# EAGLE design Blocky_STM32F103 (EAGLE 9.2.2)
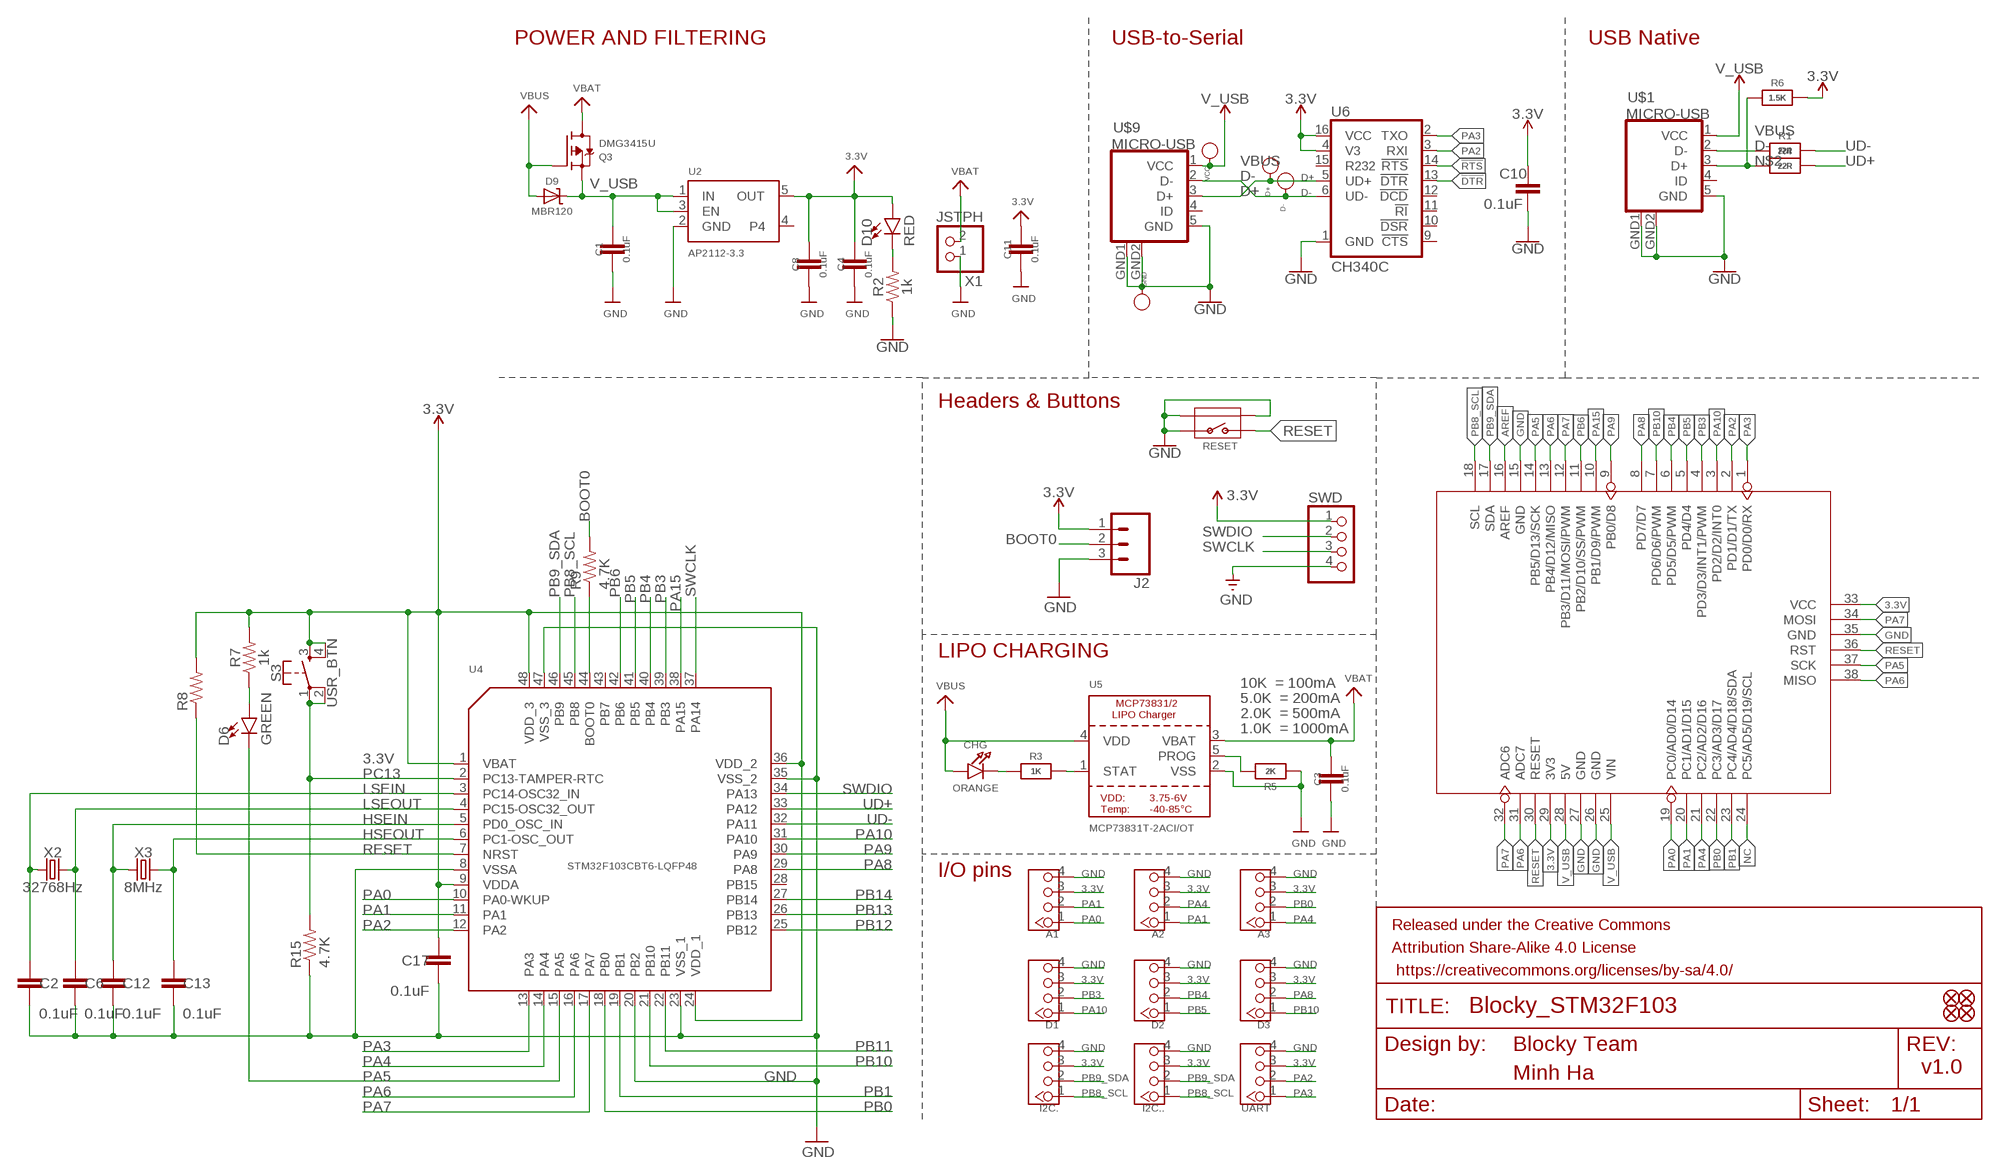
[diagram p0: schematic, sheet 1]

## Parts
A1  TWIG-4P-2.0-2.0  [4P-2.0]
A2  TWIG-4P-2.0-2.0  [4P-2.0]
A3  TWIG-4P-2.0-2.0  [4P-2.0]
C1  0.1uF  0.1UF-0603-25V-5%  [0603]
C2  0.1uF  0.1UF-0603-25V-5%  [0603]
C3  0.1uF  0.1UF-0603-25V-5%  [0603]
C4  0.1uF  0.1UF-0603-25V-5%  [0603]
C6  0.1uF  0.1UF-0603-25V-5%  [0603]
C8  0.1uF  0.1UF-0603-25V-5%  [0603]
C10  0.1uF  0.1UF-0603-25V-5%  [0603]
C11  0.1uF  0.1UF-0603-25V-5%  [0603]
C12  0.1uF  0.1UF-0603-25V-5%  [0603]
C13  0.1uF  0.1UF-0603-25V-5%  [0603]
C17  0.1uF  0.1UF-0603-25V-5%  [0603]
CHG  ORANGE  LED0603  [CHIPLED_0603]
D1  TWIG-4P-2.0-2.0  [4P-2.0]
D2  TWIG-4P-2.0-2.0  [4P-2.0]
D3  TWIG-4P-2.0-2.0  [4P-2.0]
D6  GREEN  LED-BLUE0603  [LED-0603]
D9  MBR120  DIODE-SCHOTTKYSOD-123  [SOD-123]
D10  RED  LED-RED0603  [LED-0603]
D+  PAD-TEST-POINT'4545'  [TP_4545]
D-  PAD-TEST-POINT'4545'  [TP_4545]
FD1  FIDUCIAL1X2  [FIDUCIAL-1X2]
FD2  FIDUCIAL1X2  [FIDUCIAL-1X2]
FD3  FIDUCIAL1X2  [FIDUCIAL-1X2]
FD4  FIDUCIAL1X2  [FIDUCIAL-1X2]
FRAME1  FRAME-LETTERNO_PACKAGE  [DUMMY]
GND  PAD-TEST-POINT'4545'  [TP_4545]
I2C.  TWIG-4P-2.0-2.0  [4P-2.0]
I2C..  TWIG-4P-2.0-2.0  [4P-2.0]
J2  CONN_031X03_NO_SILK  [1X03_NO_SILK]
Q3  DMG3415U  MOSFET-P  [SOT23-R]
R1  22R  RESISTOR_0603_NOOUT  [0603-NO]
R2  1k  1KOHM-0603-1/10W-1%  [0603]
R3  1K  RESISTOR_0603_NOOUT  [0603-NO]
R4  22R  RESISTOR_0603_NOOUT  [0603-NO]
R5  2K  RESISTOR_0603_NOOUT  [0603-NO]
R6  1.5K  RESISTOR_0603_NOOUT  [0603-NO]
R7  1k  1KOHM-0603-1/10W-1%  [0603]
R8  RESISTOR0603  [0603]
R9  4.7K  RESISTOR0603  [0603]
R15  4.7K  RESISTOR0603  [0603]
RESET  BUTTON-4P-REINFORCE'TS-1188E'  [4P-SMD-7X3.5X3.5H]
S3  USR_BTN  MOMENTARY-SWITCH-SPST-2-SMD-4.6X2.8MM  [TACTILE_SWITCH_SMD_4.6X2.8MM]
SWD  HEADER-1X4ROUND  [1X04_ROUND]
U2  AP2112-3.3  VREG_SOT23-5  [SOT23-5]
U3  ARDUINO-38P  [ARDUINO-38P]
U4  STM32F103CBT6-LQFP48  MCU-STM32F103CBT6(LQFP48)  [LQFP48-0.5-7X7MM]
U5  MCP73831T-2ACI/OT  MCP73831/2  [SOT23-5]
U6  CH340C  [SO016]
U$1  MICRO-USB  [MICRO-USB]
U$9  MICRO-USB  [MICRO-USB]
UART  TWIG-4P-2.0-2.0  [4P-2.0]
VCC  PAD-TEST-POINT'4545'  [TP_4545]
X1  JSTPH  CON_JST_PH_2PIN  [JSTPH2]
X2  32768Hz  CRYSTALSMD-3.2X1.5  [CRYSTAL-SMD-3.2X1.5MM]
X3  8MHz  CRYSTALSMD-5X3.2-2PAD  [CRYSTAL-SMD-5X3.2-2PAD]

## Nets
3.3V [usbvcc]: A1.3 A2.3 A3.3 C4.1 C8.1 C10.1 C11.1 C17.1 D1.3 D2.3 D3.3 D10.A I2C..3 I2C...3 J2.1 R6.2 R7.2 R8.2 S3.3 S3.4 SWD.1 U2.5(OUT) U3.29(3V3) U3.33(VCC) U4.1(VBAT) U4.9(VDDA) U4.24(VDD_1) U4.36(VDD_2) U4.48(VDD_3) U6.4(V3) U6.16(VCC) UART.3
!DTR: U6.13(!DTR)
!RTS: U6.14(!RTS)
AREF: U3.16(AREF)
BOOT0: J2.2 R9.2
D+: D+.T U6.5(UD+) U$9.3(D+)
D-: D-.T R1.1 U6.6(UD-) U$1.2(D-) U$9.2(D-)
GND: A1.4 A2.4 A3.4 C1.2 C2.2 C3.2 C4.2 C6.2 C8.2 C10.2 C11.2 C12.2 C13.2 C17.2 D1.4 D2.4 D3.4 GND.T I2C..4 I2C...4 J2.3 R2.1 R5.1 R15.1 RESET.1 RESET.S1 RESET.S2 SWD.4 U2.2(GND) U3.15(GND) U3.26(GND) U3.27(GND) U3.35(GND) U4.8(VSSA) U4.20(PB2) U4.23(VSS_1) U4.35(VSS_2) U4.47(VSS_3) U5.2(VSS) U6.1(GND) U$1.5(GND) U$1.GND1(GND) U$1.GND2(GND) U$9.5(GND) U$9.GND1(GND) U$9.GND2(GND) UART.4 X1.1
HSEIN: C12.1 U4.5(PD0_OSC_IN) X3.P$1
HSEOUT: C13.1 U4.6(PC1-OSC_OUT) X3.P$2
LSEIN: C2.1 U4.3(PC14-OSC32_IN) X2.P$1
LSEOUT: C6.1 U4.4(PC15-OSC32_OUT) X2.P$2
N$1: CHG.C R3.1
N$2 [usbvcc]: R4.1 R6.1 U$1.3(D+)
N$3: R9.1 U4.44(BOOT0)
N$4: D10.C R2.2
N$9: D6.A R7.1
NC: U3.24(PC5/AD5/D19/SCL)
PA0: A1.1 U3.19(PC0/AD0/D14) U4.10(PA0-WKUP)
PA1: A1.2 A2.1 U3.20(PC1/AD1/D15) U4.11(PA1)
PA2: U3.2(PD1/D1/TX) U4.12(PA2) U6.3(RXI) UART.2
PA3: U3.1(PD0/D0/RX) U4.13(PA3) U6.2(TXO) UART.1
PA4: A2.2 A3.1 U3.21(PC2/AD2/D16) U4.14(PA4)
PA5: D6.C U3.14(PB5/D13/SCK) U3.37(SCK) U4.15(PA5)
PA6: U3.13(PB4/D12/MISO) U3.31(ADC7) U3.38(MISO) U4.16(PA6)
PA7: U3.12(PB3/D11/MOSI/PWM) U3.32(ADC6) U3.34(MOSI) U4.17(PA7)
PA8: D3.2 U3.8(PD7/D7) U4.29(PA8)
PA9: U3.9(PB0/D8) U4.30(PA9)
PA10: D1.1 U3.3(PD2/D2/INT0) U4.31(PA10)
PA15: U3.10(PB1/D9/PWM) U4.38(PA15)
PB0: A3.2 U3.22(PC3/AD3/D17) U4.18(PB0)
PB1: U3.23(PC4/AD4/D18/SDA) U4.19(PB1)
PB3: D1.2 U3.4(PD3/D3/INT1/PWM) U4.39(PB3)
PB4: D2.2 U3.6(PD5/D5/PWM) U4.40(PB4)
PB5: D2.1 U3.5(PD4/D4) U4.41(PB5)
PB6: U3.11(PB2/D10/SS/PWM) U4.42(PB6)
PB8_SCL: I2C..1 I2C...1 U3.18(SCL) U4.45(PB8)
PB9_SDA: I2C..2 I2C...2 U3.17(SDA) U4.46(PB9)
PB10: D3.1 U3.7(PD6/D6/PWM) U4.21(PB10)
PB11: U4.22(PB11)
PB12: U4.25(PB12)
PB13: U4.26(PB13)
PB14: U4.27(PB14)
PC13: R15.2 S3.1 S3.2 U4.2(PC13-TAMPER-RTC)
PROG: R5.2 U5.5(PROG)
RESET: R8.1 RESET.2 U3.30(RESET) U3.36(RST) U4.7(NRST)
STAT: R3.2 U5.1(STAT)
SWCLK: SWD.3 U4.37(PA14)
SWDIO: SWD.2 U4.34(PA13)
UD+: R4.2 U4.33(PA12)
UD-: R1.2 U4.32(PA11)
V_USB [usbvcc]: C1.1 D9.C Q3.2(S) U2.1(IN) U2.3(EN) U3.25(VIN) U3.28(5V)
VBAT [usbvcc]: C3.1 Q3.3(D) U5.3(VBAT) X1.2
VBUS [usbvcc]: CHG.A D9.A Q3.1(G) U5.4(VDD) U$1.1(VCC) U$9.1(VCC) VCC.T ; supply symbol labelled V_USB
Unconnected: U2.4 U4.28(PB15) U4.43(PB7) U6.9(!CTS) U6.10(!DSR) U6.11(!RI) U6.12(!DCD) U6.15(R232) U$1.4(ID) U$9.4(ID)

## Notes on the sheet
- POWER AND FILTERING | USB-to-Serial | USB Native
- Headers & Buttons
- LIPO CHARGING
- 10K  = 100mA
- 5.0K  = 200mA
- 2.0K  = 500mA
- 1.0K  = 1000mA
- I/O pins
- Blocky Team
- v1.0
- Minh Ha

## Library data of the parts
A1 = Connector :TWIG-4P-2.0
A2 A3 D1-D3 I2C. I2C.. UART = Connector:TWIG-4P-2.0
C1-C4 C6 C8 C10-C13 C17 = SparkFun-Capacitors:0.1UF: 0.1µF ceramic capacitors A capacitor is a passive two-terminal electrical component used to store electrical energy temporarily in an electric field.; PROD_ID: CAP-08604
CHG = microbuilder:LED: LED 0603 - 0603 Surface Mount Package 2mA: Green LED - Low Power (3.9mcd, 2ma, 1.7Vf) - Digikey: 475-2709-2-ND Orange LED - Low Power (9.8mcd, 2ma, 1.8Vf) - Digikey: 475-1194-2-ND Red LED - Low Power (5mcd, 2ma, 1.8Vf) - Digikey: 475-1195-2-ND Yellow LED - Low Power (7mcd, 2ma, 1.8Vf) - Digikey: 475-1196-2-ND 5mA: Blue LED - Low Power (17mcd, 5ma, 2.9Vf) - Digikey: LNJ937W8CRACT-ND 0805 - 0805 Surface Mount Package 2mA: Red LED (8.8mcd, 2mA, 1.8Vf, Clear) - Low Power [Digikey: 475-2510-1-ND] Green LED (5mcd, 2mA, 1.8Vf, Clear) - Low Power [Digikey: 475-2730-1-ND] Yellow LED (11.3mcd, 2mA, 1.8Vf, Clear) - Low Power [Digikey: 475-2555-1-ND] 20mA: Red LED (104mcd, 20mA, Diffused) - LS R976 [Digikey: 475-1278-6-ND] Red LED (12mcd, 20mA, 2.0Vf, Clear) - APT2012EC [Digikey: 754-1128-1-ND] Green LED (15mcd, 20mA, 2.2Vf, Clear) - APT2012GC [Digikey: 754-1131-1-ND] Orange LED (160mcd, 20mA, 2.1Vf, Clear) - APT2012SECK [Digikey: 754-1130-1-ND] 1206 - 1206 Surface Mount Package Green LED (26mcd, 20mA, Diffused) - LG N971 [Digikey: 475-1407-6-ND] Red LED (15mcd, 20mA, Diffused) - LH N974 [Digikey: 475-1416-6-ND] Cree - Cree High-Power Surface Mount LEDs XPEBWT-L1-0000-00D50 - White 111lm 350mA 2.9Vf 6200K 110° XTEAWT-00-0000-00000LEE3 - White 114lm 350mA 2.85Vf 5000K 115° Everlight - Everlight 45-21 Series Surface Mount LEDs 45-21/QK2C-B2832AC2CB2/2T - Warm White 2000mcd 20mA 3.25Vf 3050K 120° 45-21/LK2C-B38452C4CB2/2T - Nuetral White 2000mcd 20mA 3.25Vf 4150K 120° 45-21/LK2C-B50634C6CB2/2T - Cold White 2200mcd 20mA 3.25Vf 5650K 120° PLCC2 Reverse Mount LS T77K-J1L2-1-0-2-R18-Z - Red 11.25mcd 2mA 1.8Vf 630nm 120° LO T77K-L1M2-24-Z - Orange 19.6mcd 2mA 1.8Vf 606nm 120° LY T77K-K2M1-26-Z - Yellow 15.7mcd 2mA 1.8Vf 587nm 120°
D6 = SparkFun-LED:LED-BLUE: Blue SMD LED Used in manufacturing of various products at SparkFun Packages: 0603 - SMD 0603 package [Product Link] <http://www.digikey.com/product-detail/en/SMLE12BC7TT86/511-1589-2-ND/1641808> 1206 - SMD1206 package [Product Link] <http://www.digikey.com/product-detail/en/lite-on-inc/LTST-C150TBKT/160-1643-1-ND/573584> SparkFun Products: ESP8266 Thing-Dev Board <https://www.sparkfun.com/products/13711> RedBoard <https://www.sparkfun.com/products/12757>; PROD_ID: DIO-08575; VALUE: BLUE
D9 = microbuilder:DIODE-SCHOTTKY
D10 = SparkFun-LED:LED-RED: Red SMD LED Used in manufacturing of most products at SparkFun Packages: 0603 - SMD 0603 package [Product Link] <http://docs.avagotech.com/docs/AV02-0551EN> 0603 SMART - SMD 0603 SMART package ( more efficient and expensive)[Product Link] <http://www.osram-os.com/Graphics/XPic2/00077099_0.pdf> 1206 - SMD1206 package [Product Link] <https://www.sparkfun.com/datasheets/DevTools/LilyPad/Q150OVS4.pdff> SparkFun Products: Pro Mini 328 -5V <https://www.sparkfun.com/products/821> RedBoard <https://www.sparkfun.com/products/12757> IOIO-OTG <https://www.sparkfun.com/products/13613>; PROD_ID: DIO-00819
D+ D- GND VCC = Discrete:PAD-TEST-POINT; PARTNO: DNP
FD1-FD4 = SparkFun-Aesthetics:FIDUCIAL: Fiducial Alignment Points Point-of-reference for pick-and-place machines and other optical instruments.
FRAME1 = SparkFun-Aesthetics:FRAME-LETTER: Schematic Frame Standard 8.5x11 US Letter frame; DESIGNER: Nobody; VERSION: v01
J2 = SparkFun-Connectors:CONN_03: Multi connection point. Often used as Generic Header-pin footprint for 0.1 inch spaced/style header connections On any of the 0.1 inch spaced packages, you can populate with these: Break Away Headers - Straight (PRT-00116) Break Away Male Headers - Right Angle (PRT-00553) Female Headers (PRT-00115) Break Away Headers - Machine Pin (PRT-00117) Break Away Female Headers - Swiss Machine Pin (PRT-00743) Stackable Header - 3 Pin (Female, 0.1") (PRT-13875) For SCREWTERMINALS and SPRING TERMINALS visit here: Screw Terimnals on SparkFun.com (5mm/3.5mm/2.54mm spacing) This device is also useful as a general connection point to wire up your design to another part of your project. Our various solder wires solder well into these plated through hole pads. Hook-Up Wire - Assortment (Stranded, 22 AWG) (PRT-11375) Hook-Up Wire - Assortment (Solid Core, 22 AWG) (PRT-11367) View the entire wire category on our website here Special notes: Molex polarized connector foot print use with SKU : PRT-08232 with associated crimp pins and housings.
Q3 = microbuilder:MOSFET-P: P-Channel Mosfet LEGEND VDS: Voltage Drain-Source ID: Drain Current RDS(ON): Drain-Source On-State Resistance VGS(TH): Gate-Source Threshold Voltage CISS: Drain-Source Input Capacitance SOT-23 Name VDS ID RDS(ON) VGS(TH) CISS Order Number IRLML5103 30V 760mA 600 mOhm -- 75pF @ 25V Digikey: IRLML5103PBFCT-ND IRLML6401 12V 4.3A 50 mOhm 950mV @ 250µA 830pF @ 10V Digikey: IRLML6401PBFTR-ND NTR0202PL 20V 400mA 800 mOhm 2.3V @ 250uA 70pF @ 5V Digikey: NTR0202PLT1GOSTR-ND NTR4101PT1G 20V 1.8A 85 mOhm 1.2V @ 250uA 675pF @ 10V Digikey: NTR4101PT1GOSCT-ND DMP2004K 20V 600mA 900 mOhm 1V @ 250uA 175pF @ 16V Digikey: DMP2004KDICT-ND PMV65XP 20V 3.9A 76 mOhm 950mV @ 1mA 725pF @ 20V Digikey: 568-2358-2-ND TO-252 Name VDS ID RDS(ON) VGS(TH) CISS Order Number AOD417 30V 25A 34 mOhm 3V @ 250µA 920pF @ 15V Digikey: 785-1106-2-ND PowerPak Name VDS ID RDS(ON) VGS(TH) CISS Order Number AON7401 30V 12A 14 mOhm 3V @ 250µA 2600pF @ 15V Digikey: 785-1302-1-ND
R1 R3-R6 = microbuilder:RESISTOR: Resistors For new designs, use the packages preceded by an '_' character since they are more reliable: The following footprints should be used on most boards: _0402 - Standard footprint for regular board layouts _0603 - Standard footprint for regular board layouts _0805 - Standard footprint for regular board layouts _1206 - Standard footprint for regular board layouts For extremely tight-pitch boards where space is at a premium, the following 'micro-pitch' footprints can be used (smaller pads, no silkscreen outline, etc.): _0402MP - Micro-pitch footprint for very dense/compact boards _0603MP - Micro-pitch footprint for very dense/compact boards _0805MP - Micro-pitch footprint for very dense/compact boards _1206MP - Micro-pitch footprint for very dense/compact boards
R2 R7 = SparkFun-Resistors:1KOHM: 1kΩ resistor A resistor is a passive two-terminal electrical component that implements electrical resistance as a circuit element. Resistors act to reduce current flow, and, at the same time, act to lower voltage levels within circuits. - Wikipedia; PROD_ID: RES-07856
R8 R9 R15 = SparkFun-Resistors:RESISTOR: Generic Resistor Package
RESET = Discrete:BUTTON-4P-REINFORCE: TS-1188E http://www.best-dz.com/?thread-374-2.html
S3 = SparkFun-Switches:MOMENTARY-SWITCH-SPST-2: Momentary Switch (Pushbutton) - SPST - Two Circuits Normally-open (NO) SPST momentary switches (buttons, pushbuttons). Schematic symbol includes two switch circuits. Variants SMD-4.6MMX2.8MM - 4.60mm x 2.80mm Tactile Momentary Button Switch - Used on SparkFun SAMD21 Mini Breakout SMD-5.2MM - Mini Pushbutton Switch - SMD - Used on Arduino Pro Mini; PROD_ID: SWCH-13065
SWD = microbuilder:HEADER-1X4: PIN HEADER
U2 = microbuilder:VREG_SOT23-5: SOT23-5 Fixed Voltage Regulators Part Current Out V Out V In V Dropout θJA (°C/W) TJ (°C) Digikey Part No. ADP121 150mA 3.3V 3.4-5.5V 0.09V @ 150mA -- -- ADP121-AUJZ33R7CT-ND ADP121 150mA 3.0V 3.1-5.5V 0.09V @ 150mA -- -- ADP121-AUJZ30R7CT-ND ADP122 300mA 3.3V 3.4-5.5V 0.085V @ 300mA -- -- ADP122AUJZ-3.3-R7CT-ND ADP1712 300mA 3.3V 3.5-5.5V 0.17V @ 300mA -- -- ADP1712AUJZ-3.3-R7TR-ND AP7311 (Low Cost) 150mA 3.3V 3.5-6V 0.15V @ 150mA -- -- AP7311-33WG-7DICT-ND LD39015M18R 150mA 1.8V 1.9V-5.5V 0.08V @ 100mA -- -- 497-6977-1-ND LP2985A-33DBVR 150mA 3.3V 3.3-16V 0.28V @ 150mA 206 150 296-18479-1-ND MCP1824T-3302E/OT 300mA 3.3V 3.5V-6V 0.2V @ 300mA -- -- MCP1824T-3302E/OTCT-ND MIC5205-2.5YM5 TR 150mA 2.5V 2.7-16V 0.165V @ 150mA -- -- 576-1257-2-ND MIC5205-3.0YM5 TR 150mA 3.0V 3.2V-16V 0.165V @ 150mA -- -- 576-1258-2-ND MIC5205-3.3YM5 TR 150mA 3.3V 3.5V-16V 0.165V @ 150mA -- -- 576-1259-2-ND TPS780330220 150mA 3.3V+2.2V 3.6-5.5V 250mV Max -- -- 296-23332-1-ND TDA3663/N1,135 100mA 3.3V 3.5-45V 0.18V @ 50mA -- -- 568-5343-1-ND Max operating temp can be calculated using θJA, TJ (max junction temperature), and power in watts. Set the "Maximum Ambient Temperature" until it reaches TJ ("Max Junction Temperature"), which is the absolute limit for safe use of the regulator: Heat Sink Temperature Calculator For example, With 12V source into a 3.3V LP2985 and a 30mA load, we are dissipating (12V-3.3V) * 0.03A = 0.261W. With a θJA of 206 °C/W, a TJ of 150°C, and 261mW we can safely use the chip without a heat sink up to 75°C (=147.1°C Junction Temperature).
U3 = moudle:ARDUINO-38P
U4 = Seeed-OPL-ic:MCU-STM32F103CBT6(LQFP48): 310010004; MPN: STM32F103CBT6
U5 = microbuilder:MCP73831/2: MCP73831/2 LIPO Charger VDD: 3.75 - 6V Temp -40 - 85°C Programmable Charge Rate: 15-500mA NOTE: STAT is a tri-state logic output on the MCP73831 and an open-drain output on the MCP73832. SOT23-5 with 4.2V output and tri-state logic on STAT = MCP73831T-2ACI/OT
U6 = SparkFun-IC-Comms:CH340C; PROD_ID: IC-14038
U$1 U$9 = My-Eagle-Lib:MICRO-USB: Micro USB B connector
X1 = microbuilder:CON_JST_PH_2PIN: JST 2-Pin Right-Angle Connector PH-Series - 4UConnector: 17311 SH-Series - 4UConnector: 07278
X2 X3 = SparkFun-Clocks:CRYSTAL: Crystals (Generic) These are passive quartz crystals, which can be used as a clock source for a microcontroller. Crystal's are two-terminal devices. They require external "load" capacitors to generate an oscillating signal.

## Net classes
1 power: width 0.305 mm, clearance 0.203 mm
3 usbvcc: width 0.305 mm, clearance 0.203 mm

## Board
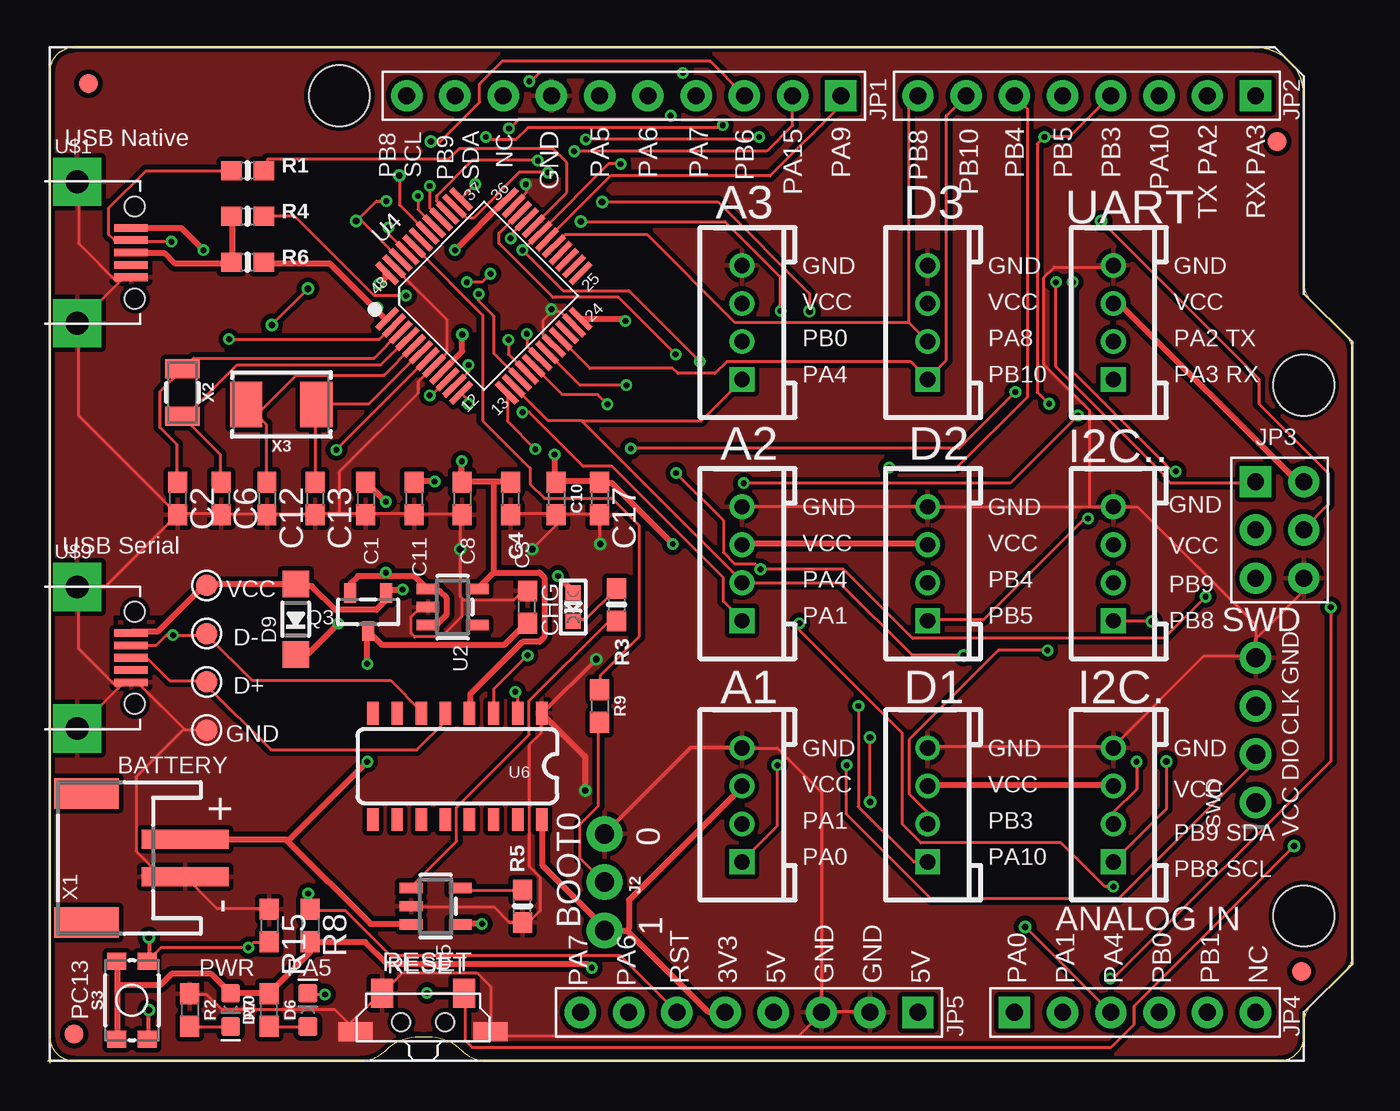
[diagram p1: board, top side]
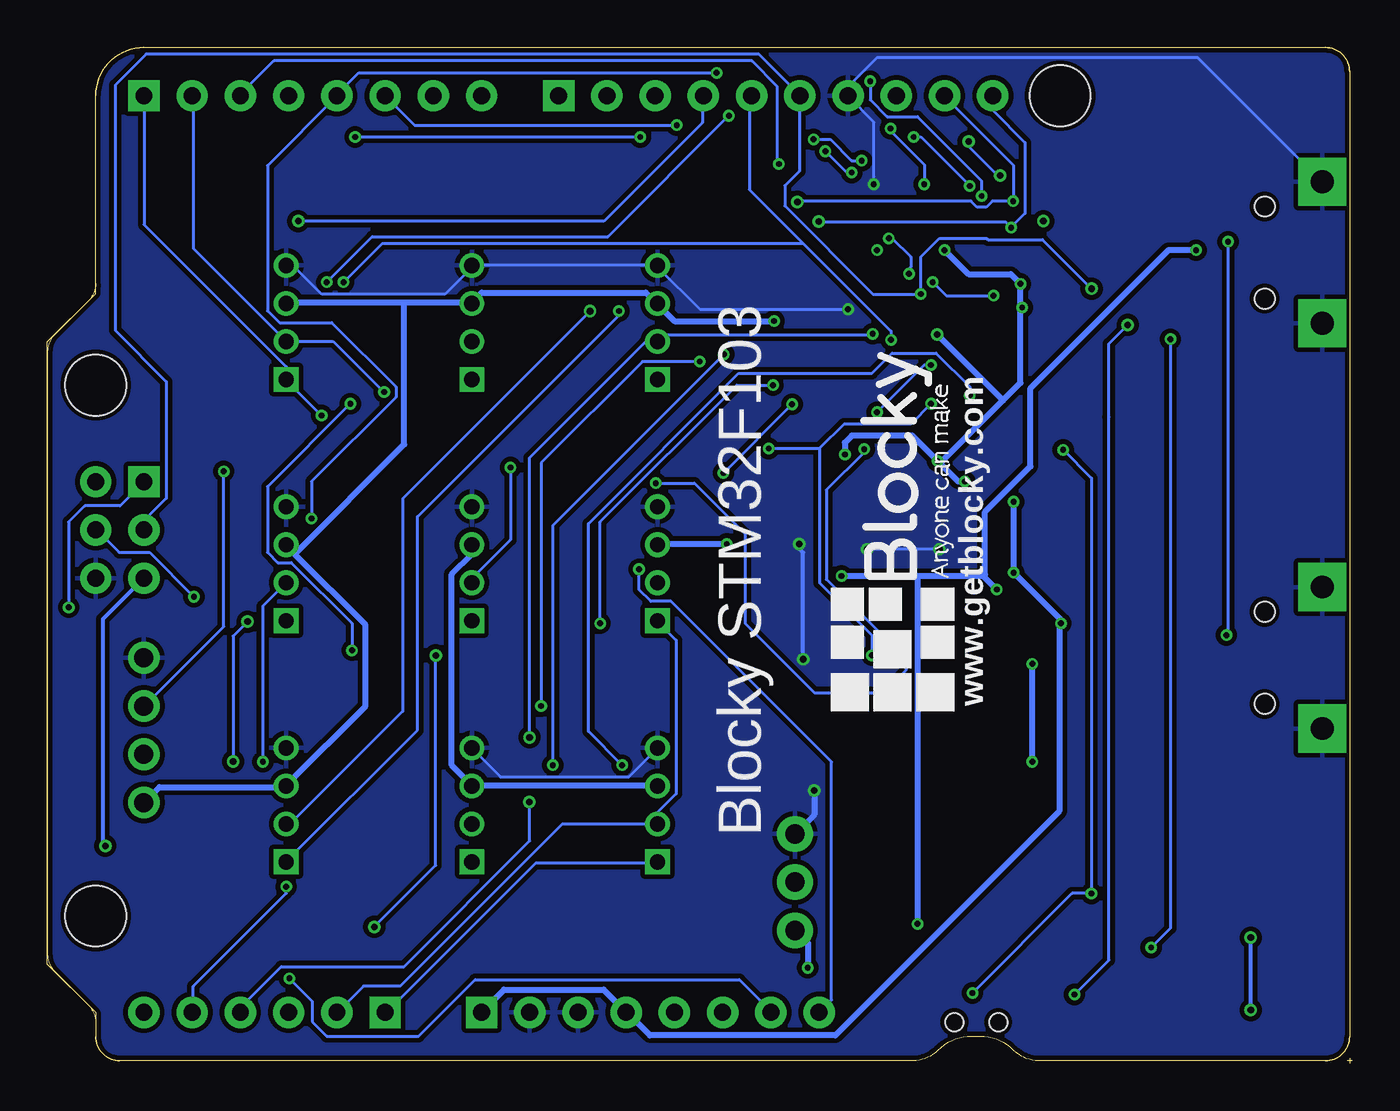
[diagram p2: board, bottom side, seen from below]

Size 68.71 x 53.47 mm. Coordinates in mm from the lower left corner, seen from the top.
Outline: 53 segments
Copper layers (1*16): Top 0.035mm / dielectric 1.5mm / Bottom 0.035mm
Design rules "SeeedStudio_rule_no_angle_090911 *": minimum track width 6mil, minimum drill 12mil, track to track 8mil, track to pad 8mil, pad to pad 8mil, via to via 8mil, smd to smd 0mil, copper to edge 10mil, drill to drill 10mil, minimum pad ring 10mil, minimum via ring 6mil, stop-mask expansion 2mil, vias tented up to drill 100mil, thermal gap 10mil

### Footprints (pad centres in the part's own frame; a part is rotated, then mirrored left to right if it is on the bottom)
4P-2.0 = drill 0.8 pad 1.27 square: 1 -3,0 | drill 0.8 pad 1.27: 2 -1,0; 3 1,0; 4 3,0
0603 = smd 1.1 x 1: 1 -0.85,0; 2 0.85,0
CHIPLED_0603 = smd 0.8 x 0.8: A 0,-0.75; C 0,0.75
LED-0603 = smd 1 x 1: A -0.877,0; C 0.877,0
SOD-123 = smd 1.4 x 1.4: A 1.85,0; C -1.85,0
TP_4545 = smd 1.143 x 1.143: T 0,0
FIDUCIAL-1X2 = smd 1 x 1: 1 0,0
1X03_NO_SILK = drill 1.016 pad 1.88: 1 0,0; 2 2.54,0; 3 5.08,0
SOT23-R = smd 0.635 x 1.016: 1 -0.95,-1; 2 0.95,-1; 3 0,1
0603-NO = smd 1.075 x 1: 1 -0.85,0; 2 0.85,0
4P-SMD-7X3.5X3.5H = smd 1.143 x 1.524: 1 -2.159,1.524; 2 2.159,1.524 | smd 1.778 x 1.016: S1 -3.556,-0.508; S2 3.556,-0.508 | hole 0.95: -1.15,0; 1.15,0
TACTILE_SWITCH_SMD_4.6X2.8MM = smd 0.9 x 1: 1 -2.05,-0.8; 2 2.05,-0.8; 3 2.05,0.8; 4 -2.05,0.8
1X04_ROUND = drill 1 pad 1.676: 1 -3.81,0; 2 -1.27,0; 3 1.27,0; 4 3.81,0
SOT23-5 = smd 0.55 x 1.2: 1 -0.95,-1.3; 2 0,-1.3; 3 0.95,-1.3; 4 0.95,1.3; 5 -0.95,1.3
ARDUINO-38P = drill 0.889 pad 1.651 square: 1 63.5,50.8; 9 41.656,50.8; 19 50.8,2.54; 25 45.72,2.54; 38 63.5,30.48 | drill 0.889 pad 1.651: 2 60.96,50.8; 3 58.42,50.8; 4 55.88,50.8; 5 53.34,50.8; 6 50.8,50.8; 7 48.26,50.8; 8 45.72,50.8; 10 39.116,50.8; 11 36.576,50.8; 12 34.036,50.8; 13 31.496,50.8; 14 28.956,50.8; 15 26.416,50.8; 16 23.876,50.8; 17 21.336,50.8; 18 18.796,50.8; 20 53.34,2.54; 21 55.88,2.54; 22 58.42,2.54; 23 60.96,2.54; 24 63.5,2.54; 26 43.18,2.54; 27 40.64,2.54; 28 38.1,2.54; 29 35.56,2.54; 30 33.02,2.54; 31 30.48,2.54; 32 27.94,2.54; 33 66.04,30.48; 34 66.04,27.94; 35 66.04,25.4; 36 63.5,25.4; 37 63.5,27.94 | hole 3.2: 15.24,50.8; 66.04,35.56; 66.04,7.62
LQFP48-0.5-7X7MM = smd 1.5 x 0.3: 1 -4.45,2.75; 2 -4.45,2.25; 3 -4.45,1.75; 4 -4.45,1.25; 5 -4.45,0.75; 6 -4.45,0.25; 7 -4.45,-0.25; 8 -4.45,-0.75; 9 -4.45,-1.25; 10 -4.45,-1.75; 11 -4.45,-2.25; 12 -4.45,-2.75; 25 4.45,-2.75; 26 4.45,-2.25; 27 4.45,-1.75; 28 4.45,-1.25; 29 4.45,-0.75; 30 4.45,-0.25; 31 4.45,0.25; 32 4.45,0.75; 33 4.45,1.25; 34 4.45,1.75; 35 4.45,2.25; 36 4.45,2.75 | smd 0.3 x 1.5: 13 -2.75,-4.45; 14 -2.25,-4.45; 15 -1.75,-4.45; 16 -1.25,-4.45; 17 -0.75,-4.45; 18 -0.25,-4.45; 19 0.25,-4.45; 20 0.75,-4.45; 21 1.25,-4.45; 22 1.75,-4.45; 23 2.25,-4.45; 24 2.75,-4.45; 37 2.75,4.45; 38 2.25,4.45; 39 1.75,4.45; 40 1.25,4.45; 41 0.75,4.45; 42 0.25,4.45; 43 -0.25,4.45; 44 -0.75,4.45; 45 -1.25,4.45; 46 -1.75,4.45; 47 -2.25,4.45; 48 -2.75,4.45
SO016 = smd 0.6 x 1.2: 1 -4.445,-2.8; 2 -3.175,-2.8; 3 -1.905,-2.8; 4 -0.635,-2.8; 5 0.635,-2.8; 6 1.905,-2.8; 7 3.175,-2.8; 8 4.445,-2.8; 9 4.445,2.8; 10 3.175,2.8; 11 1.905,2.8; 12 0.635,2.8; 13 -0.635,2.8; 14 -1.905,2.8; 15 -3.175,2.8; 16 -4.445,2.8
MICRO-USB = smd 0.4 x 1.75: 1 -1.3,4.525; 2 -0.65,4.525; 3 0,4.525; 4 0.65,4.525; 5 1.3,4.525 | drill 1.2 pad 2.54 square: GND1 -3.725,1.7; GND2 3.725,1.7 | hole 1.05: -2.425,4.73; 2.425,4.73
JSTPH2 = smd 1 x 4.6: 1 -1,-3.7; 2 1,-3.7 | smd 1.6 x 3.4: NC1 -3.4,1.5; NC2 3.4,1.5
CRYSTAL-SMD-3.2X1.5MM = smd 1 x 1.8: P$1 -1.25,0; P$2 1.25,0
CRYSTAL-SMD-5X3.2-2PAD = smd 1.7 x 2.4: P$1 1.85,0; P$2 -1.85,0

### Placement (x,y rotation side)
A1  36.58,13.59 90 top
A2  36.58,26.29 90 top
A3  36.58,38.99 90 top
C1  16.76,29.72 270 top
C2  6.86,29.72 270 top
C3  25.27,24 90 top
C4  24.38,29.72 270 top
C6  9.14,29.72 270 top
C8  21.84,29.72 270 top
C10  26.8,29.72 270 top
C11  19.3,29.72 270 top
C12  11.56,29.72 270 top
C13  14.1,29.72 270 top
C17  29.08,29.72 270 top
CHG  27.69,24 180 top
D1  46.36,13.59 90 top
D2  46.36,26.29 90 top
D3  46.36,38.99 90 top
D6  13.72,2.79 90 top
D9  13.08,23.37 90 top
D10  9.65,2.79 270 top
D+  8.38,20.07 0 top
D-  8.38,22.61 0 top
FD1  1.4,1.52 0 top
FD2  2.16,51.56 0 top
FD3  66.04,4.83 0 top
FD4  64.77,48.51 0 top
FRAME1  -6.22,-0.89 0 top  (outside the outline)
GND  8.38,17.53 0 top
I2C.  56.13,13.59 90 top
I2C..  56.13,26.29 90 top
J2  29.34,6.98 90 top
Q3  16.89,23.75 180 top
R1  10.54,46.99 0 top
R2  7.49,2.79 270 top
R3  29.97,24.13 270 top
R4  10.54,44.58 0 top
R5  25.02,8.26 90 top
R6  10.54,42.16 0 top
R7  11.68,2.79 90 top
R8  13.84,7.24 270 top
R9  29.08,18.8 270 top
R15  11.68,7.24 270 top
RESET  19.79,2.16 0 top
S3  4.44,3.3 90 top
SWD  63.63,17.53 90 top
U2  21.34,24 270 top
U3  0.13,0.13 0 top
U4  22.99,40.39 45 top
U5  20.45,8.26 270 top
U6  21.59,15.62 180 top
U$1  -0.13,42.67 270 top
U$4  [BLOCKY_LOGO]  20.7,17.53 90 bottom
U$9  -0.13,21.34 270 top
UART  56.13,38.99 90 top
VCC  8.38,25.15 0 top
X1  3.56,10.79 90 top
X2  7.11,35.31 270 top
X3  12.32,34.67 180 top

### Tracks (layer width: path | path; a pad name or v marks a point on that pad's centre or on a via)
3.3V  (via drill 0.3, 0.35)
  Top 0.305: v30.44,39.07 30.35,39.15 28.13,39.15 U4.24 | U3.33 66.09,30.62 65.82,30.62 56.49,39.95 56.13,39.95 UART.3 | 3.68,4.1 3.68,5.28 S3.3 | 3.68,4.1 3.68,1.28 S3.4 | 3.68,4.1 5.94,4.1 6.54,4.7 8.62,4.7 9.55,3.77 D10.A 9.73,3.68 11.68,3.68 R7.2 11.77,3.77 13.82,5.82 13.82,6.34 R8.2 13.85,6.36 16.74,6.36 17.91,5.19 28.49,5.19 v28.66,5.02 | U6.16 26.09,12.75 26.09,10.39 29.03,7.44 J2.1 29.46,6.97 30.53,6.97 | 30.53,6.97 34.8,2.71 35.69,2.71 U3.29 | 23.51,25.82 25.91,25.82 26.17,25.55 26.17,22.44 25.91,22.17 25.02,22.17 22.26,19.42 22.26,18.44 U6.4 | 23.51,25.82 22.71,25.02 U2.5 | 17.29,39.69 17.82,39.15 U4.1 | 17.29,39.69 14.88,42.09 11.42,42.09 R6.2 | v20.4,30.62 19.33,30.62 C11.1 | v21.82,31.69 21.82,30.62 C8.1 21.91,30.62 23.51,30.62 | 23.51,30.62 24.31,30.62 C4.1 | v17.46,41.02 17.82,41.38 17.82,41.64 U4.48 | v21.46,42.8 24.13,45.47 U4.36 | v26.71,32.04 26.71,30.71 C10.1 26.8,30.62 29.02,30.62 C17.1 29.2,30.53 29.73,30.53 v32.93,27.33 | v17.37,39.78 17.29,39.69 | 23.51,30.62 23.51,25.82 | A2.3 36.58,27.33 46.36,27.33 D2.3 | D1.3 46.36,14.62 56.13,14.62 I2C..3 | 30.53,6.97 30.62,7.06 30.62,8.57 36.58,14.53 A1.3 | U4.9 21.84,37.48 v21.84,38.35
  Bottom 0.305: v30.44,39.07 35.69,39.07 36.58,39.95 A3.3 36.66,40.04 36.68,40.04 37.2,40.56 45.83,40.56 46.27,40.13 D3.3 46.36,40.04 49.91,40.04 | 49.91,40.04 56.13,40.04 UART.3 | v28.66,5.02 28.66,6.35 29.29,6.97 J2.1 | v20.4,30.62 20.75,30.62 21.7,31.57 | 21.7,31.57 v21.82,31.69 23.16,33.03 26.34,33.03 26.71,32.66 v26.71,32.04 | 17.46,39.78 17.46,35.81 18.38,34.89 | 17.46,39.78 v17.46,41.02 17.97,41.53 20.19,41.53 v21.46,42.8 | 21.7,31.57 18.38,34.89 | v17.37,39.78 17.46,39.78 | A1.3 36.58,14.62 46.36,14.62 D1.3 46.44,14.71 47.42,15.68 47.42,25.73 46.36,26.8 D2.3 | SWD.1 63.6,13.73 62.8,14.53 56.13,14.53 I2C..3 56.05,14.71 51.96,18.8 51.96,23.06 55.69,26.8 | 55.69,26.8 56.13,27.24 I2C...3 | v32.93,27.33 36.58,27.33 A2.3 | 49.91,40.04 49.91,32.58 55.69,26.8 | v21.84,38.35 18.38,34.89
BOOT0
  Top 0.152: R9.2 29.02,17.91 29.02,13.55 28.04,12.57 28.04,10.79 29.29,9.55 J2.2
D+
  Top 0.152: U$9.3 4.48,21.29 5.28,21.29 6.44,20.13 8.31,20.13 D+.T 8.4,20.04 8.4,19.86 11.77,16.48 19.44,16.48 20.95,18 U6.5
D-  (via drill 0.3)
  Top 0.152: R1.1 9.64,46.98 5.19,46.98 3.24,45.02 3.24,43.6 3.5,43.33 U$1.2 4.48,43.24 v6.53,43.24 | U$9.2 4.48,22 5.73,22 6.26,22.53 v6.62,22.53 8.31,22.53 D-.T 8.4,22.53 10.78,20.14 18.07,20.14 19.68,18.53 U6.6
  Bottom 0.152: v6.53,43.24 6.53,22.62 v6.62,22.53
GND  (via drill 0.3, 0.35)
  Top 0.152: 3.73,41.07 1.64,38.98 U$1.GND2 1.64,38.89 1.64,34.09 6.79,28.93 C2.2 | 3.73,41.07 3.95,41.29 4.39,41.29 U$1.5 | v25.2,46.27 25.2,45.82 24.57,45.2 U4.35 | 3.73,41.07 1.64,43.16 1.64,46.36 U$1.GND1 | R15.1 11.66,8.12 8.94,8.12 7.33,9.73 X1.1 7.24,9.82 5.99,9.82 4.66,11.15 4.66,15.06 7.19,17.6 | 7.19,17.6 4.84,19.95 4.48,19.95 U$9.5 4.39,19.95 3.95,19.95 3.73,19.73 | 7.19,17.6 7.24,17.55 8.31,17.55 GND.T | 3.73,19.73 1.64,17.64 U$9.GND2 | 3.73,19.73 1.64,21.82 1.64,25.02 U$9.GND1 1.64,25.11 3.06,25.11 6.79,28.84 C2.2 | U4.47 18.26,41.91 21.02,39.15 21.02,37.38 20.4,36.75 U4.8 20.31,36.66 19.51,35.87 19.51,35.26 15.37,31.12 15.37,28.93 | C2.2 6.88,28.93 9.11,28.93 C6.2 9.2,28.93 11.51,28.93 C12.2 11.6,28.93 14.08,28.93 C13.2 14.17,28.93 15.37,28.93 | 26.8,28.93 24.4,28.93 C4.2 | 26.8,28.93 29.02,28.93 C17.2 29.11,28.84 v29.11,27.33 | 26.8,28.93 C10.2 26.8,28.32 v25.53,27.05 | 21.73,28.93 19.33,28.93 C11.2 19.24,28.93 16.84,28.93 C1.2 16.75,28.93 15.37,28.93 | 21.73,28.93 21.82,28.93 C8.2 21.73,28.93 | 21.86,24.44 21.73,24.57 v21.73,27.05 21.73,28.93 | 21.86,24.44 21.91,24.4 24.56,24.4 25.01,24.84 25.2,24.84 C3.2 | U2.2 19.95,23.95 19.6,23.95 19.15,23.51 19.15,22.62 19.33,22.44 20.75,22.44 21.82,23.51 21.82,24.4 21.86,24.44 | R2.1 7.51,3.59 8.4,3.59 9.2,2.79 15.15,2.79 16.22,1.73 RESET.S1 15.95,2.08 17.55,3.68 RESET.1 17.64,3.68 18.71,4.75 22.62,4.75 23.33,4.04 23.33,1.73 RESET.S2 23.34,1.61 23.53,1.42 39.56,1.42 40.75,2.62 U3.27 | U3.27 40.84,2.71 43.24,2.71 U3.26 | U5.2 19.15,8.22 23.52,8.22 24.32,7.42 R5.1 25.34,7.4 25.95,8.01 25.95,9.78 25.38,10.35 25.38,16.75 26,17.37 26,18.35 U6.1 26.09,18.44
  Top 0.152: 29.91,12.66 29.38,12.13 J2.3 | 36.58,16.66 A1.4 36.58,16.57 38.44,16.57 40.75,14.26 40.75,2.71 U3.27 | 26.42,39.55 27.03,39.55 27.69,38.89 U4.23 | U4.20 26.62,37.82 26.09,38.35 26.09,39.09 26.42,39.42 26.42,39.55 | v26.54,39.69 26.42,39.56 26.42,39.55 | D2.4 A2.4 | D2.4 54.89,29.29 | 54.89,29.29 I2C...4 | I2C...4 57.4,29.29 63.65,23.04 63.65,21.41 63.55,21.41 | D2.4 | U3.35 66.09,25.46 66.09,24.79 63.63,22.33 SWD.4 63.55,21.41 | 56.13,16.66 46.36,16.66 D1.4 | 63.55,21.41 60.88,21.41 56.13,16.66 | 56.13,16.66 I2C..4 | I2C...4 | 54.89,29.29 54.89,34.35 52.49,36.75 52.49,41.38 53.02,41.91 56.13,41.91 UART.4
  Top 0.203: 26.09,18.44 v28.9,21.26 | A1.4 33.86,16.59 J2.3
  Top 0.305: U6.1 28.32,16.13 v28.32,14.35
  Bottom 0.152: v25.2,46.27 25.2,49.55 26.53,50.89 U3.15 26.53,50.98 26.53,51.42 25.02,52.93 8.13,52.93 1.64,46.44 U$1.GND1 | v26.54,39.69 34.35,39.69 36.58,41.91 A3.4 36.58,42 46.36,42 D3.4 46.36,41.91 47.78,40.49 54.27,40.49 55.69,41.91 56.13,41.91 UART.4 | A1.4 36.58,16.57 38.09,15.06 44.84,15.06 46.36,16.57 D1.4 | v21.73,27.05 v25.53,27.05
  Bottom 0.203: v28.9,21.26 28.9,26.87 29.11,27.08 v29.11,27.33
  Bottom 0.305: v28.32,14.35 28.32,13.08 J2.3
  pour Bottom (isolate 0.254, rank 6): 0,0.13 68.71,0.13 68.71,53.47 0,53.47
  pour Top (isolate 0.254, rank 6): 0.13,0.13 68.71,0.13 68.71,53.47 0.13,53.47
HSEIN
  Top 0.152: C12.1 11.51,30.62 11.51,33.64 10.53,34.62 X3.P$1 11.06,34.18 13.11,36.22 17.73,36.22 19.24,37.73 U4.5
HSEOUT
  Top 0.152: C13.1 14.08,30.62 14.08,34.62 X3.P$2 14.17,34.71 16.93,34.71 19.6,37.38 U4.6
LSEIN
  Top 0.152: C2.1 6.79,30.62 6.79,32.58 5.91,33.46 5.91,35.33 7.06,36.49 X2.P$1 7.15,36.58 7.68,37.11 17.2,37.11 18.53,38.44 U4.3
LSEOUT
  Top 0.152: C6.1 9.11,30.62 9.11,32.04 7.15,34 X2.P$2 7.24,34 10,36.75 17.55,36.75 18.88,38.09 U4.4
N$1
  Top 0.152: CHG.C 27.69,23.33 28.31,23.33 29.91,24.93 R3.1
N$2
  Top 0.305: R4.1 9.73,44.58 9.73,42.18 R6.1 9.64,42.09 6.71,42.09 6.17,42.62 4.48,42.62 U$1.3
N$3
  Top 0.152: R9.1 29.11,19.68 29.11,20.4 31.15,22.44 31.15,28.31 29.73,29.73 26.17,29.73 25.42,30.48 25.42,31.32 22.92,33.82 22.92,39.38 19.33,42.98 U4.44
N$4
  Top 0.152: D10.C 9.64,1.91 7.51,1.91 R2.2
N$9
  Top 0.152: D6.A 13.64,1.91 11.68,1.91 R7.1
PA0  (via drill 0.3)
  Top 0.152: v20.13,35.15 20.22,35.15 21.02,35.95 U4.10 | v38.44,15.68 38.44,12.48 36.58,10.62 A1.1
  Bottom 0.152: v20.13,35.15 20.13,35.6 21.91,37.38 24.22,37.38 25.29,36.31 32.31,36.31 40.22,28.4 40.22,17.46 v38.44,15.68 | U3.19 50.89,2.71 50.81,2.71 42.99,10.53 36.58,10.53 A1.1
PA1  (via drill 0.3)
  Top 0.152: v22.17,36.75 22.17,36.4 21.46,35.69 U4.11 | v25.02,34.27 25.38,34.27 28.22,31.42 29.73,31.42 35.6,25.55 35.6,24.31 36.58,23.33 A2.1
  Bottom 0.152: v22.17,36.75 22.53,36.75 v25.02,34.27 | A2.1 36.58,23.24 35.6,22.26 35.6,14.17 36.58,13.2 A1.2 36.58,12.57 41.61,12.57 50.13,4.05 52.06,4.05 53.4,2.71 53.47,2.71 U3.20
PA2  (via drill 0.3)
  Top 0.152: v25.29,21.46 23.51,19.68 23.51,18.44 U6.3 | v22.17,34.71 22.17,34.89 21.82,35.24 U4.12 | v50.98,35.33 48.01,32.36 v30.72,32.36
  Bottom 0.152: v25.29,21.46 25.29,22.53 28.04,25.29 28.04,32.36 | v22.17,34.71 23.24,33.64 26.76,33.64 28.04,32.36 | U3.2 61.02,50.89 61.02,42.89 56.13,38 UART.2 53.67,37.99 51.02,35.33 v50.98,35.33 | v30.72,32.36 28.04,32.36
PA3  (via drill 0.3)
  Top 0.152: v24.64,19.54 24.75,19.43 24.75,18.44 U6.2 | v25.69,32.32 24.22,33.8 24.22,35.24 U4.13 | v36.66,30.53 50.71,30.53 v54.27,34.09
  Bottom 0.152: v25.69,32.32 25.69,32.17 27.69,30.17 27.69,25.46 23.51,21.29 23.51,20.68 v24.64,19.54 24.64,19.51 28.32,19.51 31.97,23.15 31.97,27.86 34.63,30.53 v36.66,30.53 | U3.1 63.61,50.91 63.61,44.15 56.13,36.66 UART.1 56.13,35.95 v54.27,34.09
PA4  (via drill 0.35)
  Top 0.152: 28.13,33.82 26.35,33.82 24.57,35.6 U4.14 | A3.1 36.58,35.95 34.44,33.82 28.13,33.82 | 28.13,33.82 36.58,25.38 | 36.58,25.38 A2.2 | U3.21 55.96,2.71 v51.49,7.17 | 36.58,25.38 36.69,25.26 41.75,25.26 45.54,21.46 v48.26,21.46
  Bottom 0.152: v51.49,7.17 48.26,10.4 v48.26,21.46
PA5  (via drill 0.3, 0.35)
  Top 0.152: v14.62,3.61 13.78,3.61 D6.C | v22.71,40.49 22.71,40.13 23.53,39.31 23.53,37.35 24.84,36.04 U4.15 | v11.81,38.86 v13.72,40.77
  Bottom 0.152: v14.62,3.61 12.8,5.42 12.8,34.01 | U3.37 63.6,28.13 63.6,28.57 62.45,29.73 62.45,35.88 65.14,38.57 65.14,51.49 63.51,53.11 31.24,53.11 29.11,50.98 U3.14 29.11,50.89 29.11,46.95 29.87,46.19 29.87,45.12 25.23,40.49 v22.71,40.49 22.71,42.44 21.73,43.42 19.24,43.42 19.18,43.36 16.31,43.36 v13.72,40.77 | 12.8,34.01 12.83,34.04 | 12.8,34.01 12.8,37.87 v11.81,38.86
PA6  (via drill 0.3)
  Top 0.152: v24.28,38.08 24.28,37.31 25.2,36.4 U4.16 | v55.97,4.46 56.1,4.58 56.27,4.58 67.59,15.9 v67.59,23.99 | v53.11,41.11 53.11,36.66 58.8,30.97 58.8,30.89 59.16,30.53 63.6,30.53 U3.38
  Bottom 0.152: v24.28,38.08 24.28,38.53 28.9,43.16 | 28.9,43.16 31.74,45.99 31.74,50.84 31.69,50.89 U3.13 | U3.31 30.61,2.73 32.27,4.39 46.18,4.39 49.15,1.42 54,1.42 54.76,2.18 54.76,3.25 v55.97,4.46 | v67.59,23.99 67.59,28.49 66.74,29.34 64.88,29.34 63.69,30.53 U3.38 | 28.9,43.16 51.07,43.16 v53.11,41.11
PA7  (via drill 0.3, 0.35)
  Top 0.152: v29.49,34.68 28.98,35.19 27.11,35.19 25.64,36.66 U4.17 | v33.11,31.06 35.6,28.57 35.6,26.89 36.22,26.26 37.29,26.26 v37.55,26 41.91,26 45.55,22.35 58.8,22.35 v61,24.55 | U3.34 66.18,28.13 67.46,29.41 67.46,31.06 63.8,34.72 63.8,36.02 v55.5,44.32
  Bottom 0.152: v33.11,31.06 v29.49,34.68 | v37.55,26 37.55,24.93 36.93,24.31 35.87,24.31 27.41,15.85 27.41,3.33 U3.32 | v61,24.55 63.34,26.89 64.94,26.89 66.09,28.04 U3.34 | U3.12 34.21,50.88 34.21,49.52 39.41,44.32 v55.5,44.32
PA8
  Top 0.152: 45.38,38.98 36.22,38.98 31.6,43.6 27.24,43.6 26.71,43.07 U4.29 | 45.38,38.98 46.36,38 D3.2 | U3.8 45.82,50.93 45.38,50.48 45.38,38.98
PA9
  Top 0.152: U3.9 41.78,50.43 38.06,46.71 29.64,46.71 26.35,43.42 U4.30
PA10  (via drill 0.3)
  Top 0.152: D1.1 45.62,10.59 42.71,13.5 v42.71,18.8 | v34.35,36.93 30.62,40.66 27.16,40.66 v25.03,42.8 v25.02,42.8 25.91,43.69 U4.31 25.96,43.74 29.55,47.33 v30.19,47.33
  Bottom 0.152: v42.71,18.8 42.71,31.6 37.38,36.93 v34.35,36.93 | U3.3 58.55,51 56.79,52.76 31.61,52.76 30.26,51.41 30.26,47.41 v30.19,47.33
PA15  (via drill 0.3)
  Top 0.152: v26.35,46.89 24.84,46.89 22.44,44.49 22.08,44.49 21.46,45.11 U4.38 | v27.74,48.01 37.88,48.01 39.24,49.37 U3.10
  Bottom 0.152: v26.35,46.89 26.62,46.89 v27.74,48.01
PB0  (via drill 0.3, 0.35)
  Top 0.152: v25.25,38.39 25.25,37.77 25.91,37.11 U4.18 | v43.33,13.74 43.33,17.12 v43.31,17.14 v43.32,17.14
  Bottom 0.152: v25.25,38.39 25.29,38.35 36.22,38.35 36.58,38 A3.2 36.58,37.91 37.26,37.91 43.32,31.85 v43.32,17.14 | U3.22 58.55,2.92 56.39,5.08 49.92,5.08 43.31,11.7 43.31,13.72 v43.33,13.74
PB1  (via drill 0.3)
  Top 0.152: v30.49,35.69 28.04,35.69 26.35,37.38 U4.19 | v39.6,23.15 39.6,22.8 45.02,17.37 45.02,12.57 46,11.6 53.38,11.6 55.69,9.28 v56.13,9.28
  Bottom 0.152: v30.49,35.69 32.4,35.69 39.6,28.49 v39.6,23.15 | v56.13,9.28 56.13,8.93 61.02,4.04 61.02,2.71 U3.23
PB3  (via drill 0.3)
  Top 0.152: v25.82,47.51 25.81,47.52 22.36,47.52 20.48,45.64 20.48,45.38 21.02,44.84 U4.39 | v37.49,48.76 37.36,48.63 v28.36,48.63 | U3.4 55.96,50.89 53.82,48.76 v52.5,48.76 52.13,48.39 52.13,35.31 52.73,34.71 v52.76,34.71 | D1.2 46.36,13.2 45.38,14.17 45.38,17.02 50.09,21.73 v52.67,21.73
  Bottom 0.152: v25.82,47.51 26.35,47.51 27.47,48.63 v28.36,48.63 | v52.5,48.76 v37.49,48.76 | v52.67,21.73 52.67,23.15 55.87,26.35 56.58,26.35 57.11,26.89 57.11,30.35 v52.76,34.71
PB4  (via drill 0.3)
  Top 0.152: v20.13,46.18 20.13,45.02 20.66,44.49 U4.40 | v23.09,48.76 23.09,48.62 24.66,48.62 25.3,49.25 35.43,49.25 v35.56,49.38 | v44.32,31.36 47.89,31.36 51.6,35.07 51.6,50.25 U3.6
  Bottom 0.152: v23.09,48.76 22.71,48.76 v20.13,46.18 | v35.56,49.38 49.38,49.38 U3.6 | D2.2 46.36,25.53 44.32,27.56 v44.32,31.36
PB5  (via drill 0.3)
  Top 0.152: v19.51,45.64 19.51,44.93 20.31,44.13 U4.41 | v25.38,51.69 25.48,51.69 25.95,52.16 33.44,52.16 v33.46,52.13 | v54.8,28.66 54.62,28.66 49.29,23.33 46.36,23.33 D2.1
  Bottom 0.152: v19.51,45.64 19.51,46.44 22.88,49.82 24.49,49.82 25.38,50.71 v25.38,51.69 | v33.46,52.13 52.31,52.13 53.47,50.98 U3.5 53.47,50.89 57.11,47.24 57.11,39.6 56.49,38.98 53.73,38.98 50.36,35.6 50.36,35.07 54.8,30.62 v54.8,28.66
PB6  (via drill 0.35)
  Top 0.152: U4.42 19.95,43.78 18.54,45.19 v18.54,46.74 | U3.11 36.66,50.98 34.91,52.73 23.94,52.73 22.76,51.55 22.76,50.58 20.69,48.51 v20.19,48.51
  Bottom 0.152: v20.19,48.51 20.19,48.26 18.67,46.74 v18.54,46.74
PB8_SCL  (via drill 0.3, 0.35)
  Top 0.152: v17.96,43.98 17.96,43.64 18.88,42.71 U4.45 | v38.61,39.6 38.61,41.38 35.68,44.3 v28.09,44.3 | I2C...1 58.12,23.29 v58.17,23.24 | v58.93,15.88 58.93,13.38 I2C..1
  Bottom 0.152: U3.18 18.92,50.16 17.22,48.46 17.22,44.73 17.96,43.99 v17.96,43.98 18.26,44.29 28.07,44.29 v28.09,44.3 | 56.13,23.24 I2C...1 | v38.61,39.6 38.61,39.38 49.23,28.77 49.23,17.53 56.13,10.62 I2C..1 | v58.17,23.24 58.93,22.48 v58.93,15.88
PB9_SDA  (via drill 0.3, 0.35)
  Top 0.152: U4.46 18.53,42.35 16.56,44.32 v16.26,44.32 17.31,45.38 v17.84,45.38 | I2C..2 56.13,13.2 57.37,14.43 v57.37,15.86 | v29.21,45.34 35.31,45.34 40.13,40.51 v40.13,39.58
  Bottom 0.152: U3.17 21.46,50.89 17.84,47.27 v17.84,45.38 18.95,45.38 19.27,45.06 19.75,45.06 20.07,45.38 29.04,45.38 29.08,45.34 v29.21,45.34 | v57.37,15.86 57.37,24.05 I2C...2 | v40.13,39.58 50,29.71 50,18.51 55.93,12.59 I2C..2
PB10
  Top 0.152: U4.21 27.06,38.09 28.57,36.58 32.93,36.58 33.2,36.31 35.15,36.31 35.78,36.93 45.47,36.93 46.36,36.04 D3.1 46.34,36.01 47.33,37.01 47.33,49.89 48.31,50.86 48.31,50.89 U3.7
PC13  (via drill 0.3, 0.35)
  Top 0.152: 5.02,1.19 5.19,1.19 S3.1 | 5.19,5.37 S3.2 5.28,5.37 5.35,5.44 5.99,6.08 v10.58,6.08 10.83,6.34 11.68,6.34 R15.2 | v9.56,38.11 17.49,38.11 18.17,38.8 U4.2
  Top 0.203: S3.1 5.33,1.34 v5.33,2.79 | v5.33,6.6 5.35,6.58 5.35,5.44
  Bottom 0.152: v9.56,38.11 9.56,7.1 v10.58,6.08
  Bottom 0.203: v5.33,2.79 v5.33,6.6
PROG
  Top 0.152: R5.2 21.91,9.11 21.82,9.2 U5.5
RESET  (via drill 0.3, 0.35)
  Top 0.152: U3.30 30.17,5.64 18.08,5.64 15.7,8.03 13.91,8.03 R8.1 13.82,8.06 13.82,7.86 13.73,7.95 v13.73,8.93 | v15.21,32.28 19.95,37.02 U4.7 | v19.99,3.68 RESET.2 22,3.68 22,1.19 22.35,0.84 56.03,0.84 57.24,2.04 57.24,3.01 v65.66,11.43
  Bottom 0.152: v15.21,32.28 13.73,30.8 v13.73,8.93 14.75,8.93 v19.99,3.68
  Bottom 0.203: U3.36 65.79,23.37 65.79,11.56 v65.66,11.43
STAT
  Top 0.152: R3.2 29.91,23.24 29.55,23.24 25.38,19.06 25.38,17.29 21.55,13.46 21.55,11.68 19.15,9.28 U5.1
SWCLK  (via drill 0.3)
  Top 0.152: v22.53,46.27 21.79,45.52 U4.37 | v24.31,49.2 24.33,49.2 24.83,49.7 32.64,49.7 v32.82,49.87 | v54,41.11 54,36.4 59.25,31.15 v59.42,31.15
  Bottom 0.152: v22.53,46.27 22.53,47.3 24.31,49.07 v24.31,49.2 | v32.82,49.87 32.83,49.87 39.19,43.51 51.6,43.51 v54,41.11 | v59.42,31.15 59.42,22.97 63.6,18.8 SWD.3
SWDIO  (via drill 0.3)
  Top 0.152: v33.08,37.31 30.09,40.31 26.62,40.31 23.77,43.16 23.77,43.69 24.84,44.76 U4.34 | v42.09,15.68 42.09,13.11 46.53,8.66 56.4,8.66 63.6,15.86 63.6,16.22 SWD.2
  Bottom 0.152: v33.08,37.31 42.09,28.31 v42.09,15.68
UD+  (via drill 0.3)
  Top 0.152: R4.2 13.02,44.58 17.2,40.4 v18.88,40.4 | v22.08,41.11 22.88,41.11 v23.33,41.55 | v24.4,43.42 24.4,43.6 25.2,44.4 U4.33
  Bottom 0.152: v18.88,40.4 21.37,40.4 v22.08,41.11 | v23.33,41.55 23.33,41.82 23.24,41.91 23.24,42.44 24.22,43.42 v24.4,43.42
UD-
  Top 0.152: R1.2 11.59,47.57 21.12,47.57 21.68,48.13 26.62,48.13 27.36,47.4 27.36,45.85 25.64,44.13 U4.32
V_USB  (via drill 0.3)
  Top 0.305: Q3.2 15.94,25.22 16.36,25.64 17.82,25.64 | 17.82,25.64 19.33,25.64 19.95,25.02 U2.1 20.13,24.84 20.66,24.84 21.02,24.49 21.02,23.6 20.48,23.06 U2.3 | v17.82,29.55 16.84,30.53 C1.1 | v17.82,25.82 17.82,25.64 | v15.33,23.15 13.73,21.55 13.11,21.55 D9.C
  Bottom 0.305: U3.25 45.82,2.71 44.67,3.86 39.42,3.86 U3.28 38.17,2.64 36.98,1.46 27.22,1.46 15.42,13.26 15.42,23.06 v15.33,23.15 15.33,23.33 v17.82,25.82 v17.82,29.55
  pour Top (isolate 0.254, no thermals): 3.81,23.24 5.97,23.24 5.97,22.54 3.81,22.54
VBAT  (via drill 0.3)
  Top 0.305: C3.1 25.2,23.15 24.04,22 17.63,22 16.89,22.73 Q3.3 16.84,22.62 v16.84,21.02 | 12.66,11.68 12.57,11.77 7.33,11.77 X1.2 | 12.66,11.68 17.02,7.33 19.06,7.33 U5.3 | 12.66,11.68 v16.84,15.86
  Bottom 0.305: v16.84,15.86 v16.84,21.02
VBUS  (via drill 0.3)
  Top 0.305: U$9.1 4.48,22.71 5.82,22.71 8.31,25.2 VCC.T 8.4,25.2 13.02,25.2 D9.A 13.2,25.11 13.92,25.11 15.16,23.86 17.31,23.86 17.84,24.39 Q3.1 17.91,24.75 18.08,24.93 v18.71,24.93 | v26.89,25.64 27.69,24.84 CHG.A | v22.88,7.33 21.82,7.33 U5.4 | v8.22,42.8 7.06,43.96 4.48,43.96 U$1.1
  Bottom 0.305: 19.42,25.64 22.88,25.64 | 22.88,25.64 v26.89,25.64 | v18.71,24.93 19.42,25.64 | 22.88,25.64 v22.88,7.33 | v8.22,42.8 9.67,42.8 16.93,35.54 16.93,31.42 19.33,29.02 19.33,25.73 19.42,25.64

### Text on the board
tPlace: USB Native | NC | PA2 | PA3 | PB8 / SCL | PB9 / SDA | GND | PA5 | PA6 | PA7 | PB6 | PA15 | PA9 | PB8 | PB10 | PB4 | PB5 | PB3 | PA10 | TX | RX | GND | GND | GND | VCC | VCC | VCC | PB0 | PA8 | PA2 TX | PA4 | PB10 | PA3 RX | GND | GND | GND | USB Serial | VCC | VCC | VCC | PA4 | PB4 | PB9 | PA1 | PB5 | PB8 | SWD | GND | CLK | GND | GND | GND | BATTERY | DIO | VCC | VCC | VCC | + | PA1 | PB3 | PB9 SDA | VCC | 0 | PA0 | PA10 | PB8 SCL | - | BOOT0 | 1 | ANALOG IN | RESET | PWR | PA5 | PA7 | PA6 | RST | 3V3 | 5V | GND | GND | 5V | PA0 | PA1 | PA4 | PB0 | PB1 | NC | PC13
bPlace: Blocky STM32F103
bPlate: A0 | A2 | A4 | SPI | UART